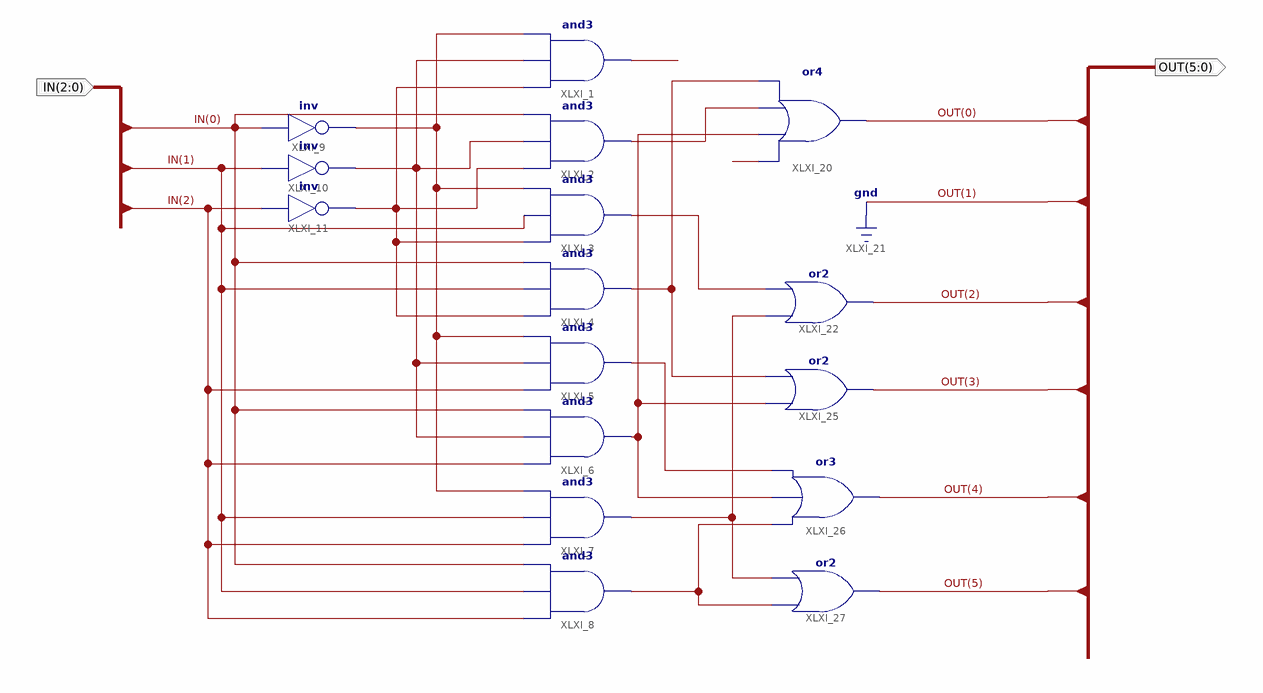
[diagram p0: schematic sheet 1]
// Xilinx ISE schematic C3_8.sch (kintex7) as structural Verilog: 16 symbols, 2 ports
module C3_8 (
  input  [2:0] IN,
  output [5:0] OUT
);

  wire XLXN_6, XLXN_12, XLXN_22, XLXN_39, XLXN_40, XLXN_41, XLXN_43, XLXN_44, XLXN_47, XLXN_48, XLXN_52,
       XLXN_53;

  not XLXI_9 (XLXN_6, IN[0]);
  not XLXI_10 (XLXN_12, IN[1]);
  not XLXI_11 (XLXN_22, IN[2]);
  and XLXI_1 (XLXN_40, XLXN_22, XLXN_12, XLXN_6);
  and XLXI_2 (XLXN_39, XLXN_22, XLXN_12, IN[0]);
  and XLXI_3 (XLXN_41, XLXN_22, IN[1], XLXN_6);
  and XLXI_4 (XLXN_43, XLXN_22, IN[1], IN[0]);
  and XLXI_5 (XLXN_44, IN[2], XLXN_12, XLXN_6);
  and XLXI_6 (XLXN_47, IN[2], XLXN_12, IN[0]);
  and XLXI_7 (XLXN_53, IN[2], IN[1], XLXN_6);
  and XLXI_8 (XLXN_52, IN[2], IN[1], IN[0]);
  or XLXI_20 (OUT[0], XLXN_48, XLXN_47, XLXN_39, XLXN_43);
  or XLXI_22 (OUT[2], XLXN_53, XLXN_41);
  or XLXI_25 (OUT[3], XLXN_47, XLXN_43);
  or XLXI_26 (OUT[4], XLXN_52, XLXN_47, XLXN_44);
  or XLXI_27 (OUT[5], XLXN_52, XLXN_53);

  assign OUT[1] = 1'b0;
endmodule
